# Altium project LUMW.PrjPCB
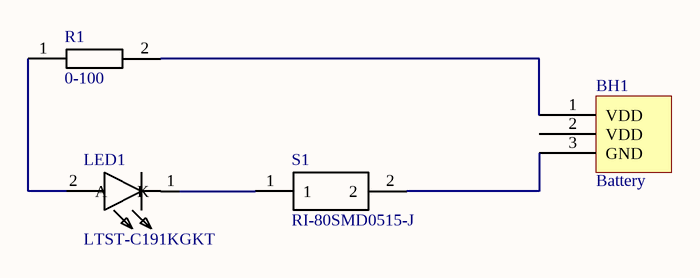
[diagram p0: LUMW.SchDoc]
1 sheet, 4 parts. Net scope: global (net labels, ports and power ports of the same name join across sheets).
Board file: LUMW.PcbDoc

## Sheet LUMW.SchDoc
size A

### Parts
BH1  Battery  [BHX1-1025-PC]
LED1  LTST-C191KGKT  [LEDC1608X55N]
R1  0-100  [RESC1005X40N]
S1  RI-80SMD0515-J  [RI80SMD0510J]

### Nets
NetBH1_1: BH1.1(VDD) R1.2
NetBH1_3: BH1.3(GND) S1.2
NetLED1_1: LED1.1(K) S1.1
NetLED1_2: LED1.2(A) R1.1

Not connected (* = marked no-connect by the designer): BH1 2(VDD)

### Library data of the parts
BH1 = BH?: Battery Holder for BK-870
LED1 = LTST-C191KGKT: LED; Manufacturer_Name: Lite-On; Datasheet Link: http://www.mouser.com/ds/2/239/S_110_LTST-C191KGKT-369560.pdf; Height: 0.55mm; Manufacturer_Part_Number: LTST-C191KGKT; Mouser Part Number: 859-LTST-C191KGKT; Mouser Price/Stock: https://www.mouser.com/Search/Refine.aspx?Keyword=859-LTST-C191KGKT; RS Part Number: 6921010P; RS Price/Stock: http://uk.rs-online.com/web/p/products/6921010P
R1 = RMCF0402ZT0R00: Resistor; Manufacturer_Name: Stackpole Electronics Inc.; Datasheet Link: https://www.seielect.com/catalog/sei-rmcf_rmcp.pdf; Height: 0.4mm; Manufacturer_Part_Number: RMCF0402ZT0R00
S1 = RI-80SMD0515-J: Switch; Manufacturer_Name: Coto Technology; Datasheet Link: http://www.comus-intl.com/wp-content/uploads/2018/10/RI-80SMD.pdf; Manufacturer_Part_Number: RI-80SMD0515-J; Mouser Part Number: 816-RI-80SMD0515-J; Mouser Price/Stock: https://www.mouser.com/Search/Refine.aspx?Keyword=816-RI-80SMD0515-J